# EAGLE design SimpleLedEgg (EAGLE 9.6.2)
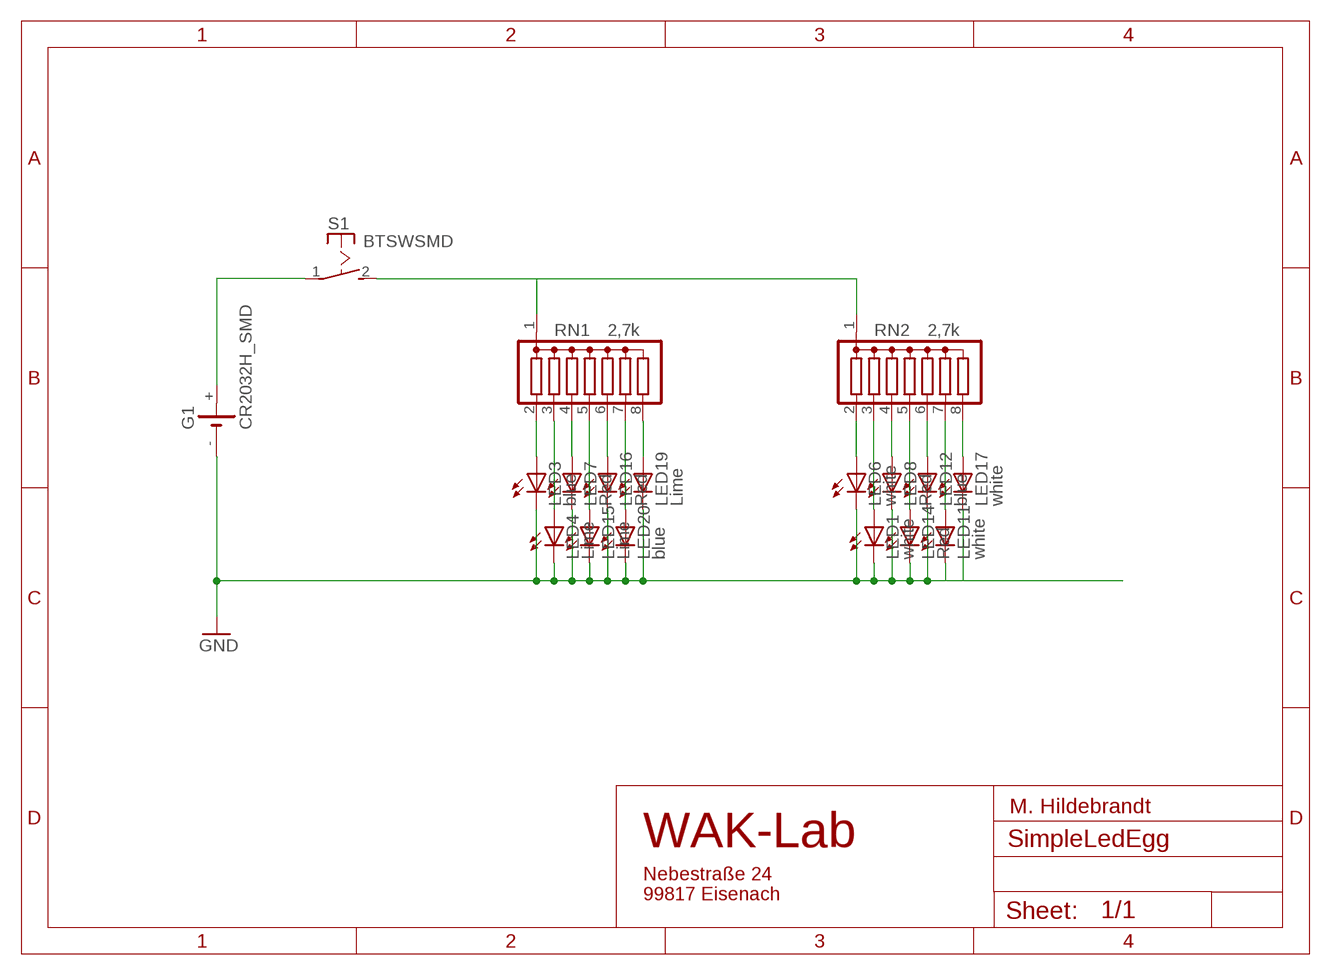
[diagram p0: schematic, sheet 1]

## Parts
G1  CR2032H_SMD  [CR2032H_SMD]
LED1  white  LED3MM  [LED3MM]
LED3  blue  LED3MM  [LED3MM]
LED4  Lime  LED3MM  [LED3MM]
LED6  white  LED3MM  [LED3MM]
LED7  Red  LED3MM  [LED3MM]
LED8  Red  LED3MM  [LED3MM]
LED11  white  LED3MM  [LED3MM]
LED12  blue  LED3MM  [LED3MM]
LED14  Red  LED3MM  [LED3MM]
LED15  Lime  LED3MM  [LED3MM]
LED16  Red  LED3MM  [LED3MM]
LED17  white  LED3MM  [LED3MM]
LED19  Lime  LED3MM  [LED3MM]
LED20  blue  LED3MM  [LED3MM]
RN1  2,7k  G07R  [SIL8]
RN2  2,7k  G07R  [SIL8]
S1  BTSWSMD  [BTSW_SMD]

## Nets
GND: G1.- LED1.K(C) LED3.K(C) LED4.K(C) LED6.K(C) LED7.K(C) LED8.K(C) LED11.K(C) LED12.K(C) LED14.K(C) LED15.K(C) LED16.K(C) LED17.K(C) LED19.K(C) LED20.K(C)
N$1: RN1.1 RN2.1 S1.2(S)
N$2: LED3.A RN1.2
N$3: LED4.A RN1.3
N$4: LED7.A RN1.4
N$5: LED15.A RN1.5
N$6: LED16.A RN1.6
N$7: LED20.A RN1.7
N$8: LED19.A RN1.8
N$9: LED6.A RN2.2
N$10: LED1.A RN2.3
N$11: LED8.A RN2.4
N$12: LED12.A RN2.6
N$13: LED14.A RN2.5
N$14: LED11.A RN2.7
N$15: LED17.A RN2.8
N$49: G1.+ S1.1(P)

## Notes on the sheet
- M. Hildebrandt
- WAK-Lab
- Nebestraße 24
  99817 Eisenach

## Library data of the parts
G1 = battery:CR2032H_SMD
LED1 LED3 LED4 LED6-LED8 LED11 LED12 LED14-LED17 LED19 LED20 = led:LED: LED OSRAM: - CHIPLED LG R971, LG N971, LY N971, LG Q971, LY Q971, LO R971, LY R971 LH N974, LH R974 LS Q976, LO Q976, LY Q976 LO Q996 - Hyper CHIPLED LW Q18S LB Q993, LB Q99A, LB R99A - SideLED LS A670, LO A670, LY A670, LG A670, LP A670 LB A673, LV A673, LT A673, LW A673 LH A674 LY A675 LS A676, LA A676, LO A676, LY A676, LW A676 LS A679, LY A679, LG A679 - Hyper Micro SIDELED® LS Y876, LA Y876, LO Y876, LY Y876 LT Y87S - SmartLED LW L88C, LW L88S LB L89C, LB L89S, LG L890 LS L89K, LO L89K, LY L89K LS L896, LA L896, LO L896, LY L896 - TOPLED LS T670, LO T670, LY T670, LG T670, LP T670 LSG T670, LSP T670, LSY T670, LOP T670, LYG T670 LG T671, LOG T671, LSG T671 LB T673, LV T673, LT T673, LW T673 LH T674 LS T676, LA T676, LO T676, LY T676, LB T676, LH T676, LSB T676, LW T676 LB T67C, LV T67C, LT T67C, LS T67K, LO T67K, LY T67K, LW E67C LS E67B, LA E67B, LO E67B, LY E67B, LB E67C, LV E67C, LT E67C LW T67C LS T679, LY T679, LG T679 LS T770, LO T770, LY T770, LG T770, LP T770 LB T773, LV T773, LT T773, LW T773 LH T774 LS E675, LA E675, LY E675, LS T675 LS T776, LA T776, LO T776, LY T776, LB T776 LHGB T686 LT T68C, LB T68C - Hyper Mini TOPLED® LB M676 - Mini TOPLED Santana® LG M470 LS M47K, LO M47K, LY M47K Source: http://www.osram.convergy.de LUXEON: - LUMILED® LXK2-PW12-R00, LXK2-PW12-S00, LXK2-PW14-U00, LXK2-PW14-V00 LXK2-PM12-R00, LXK2-PM12-S00, LXK2-PM14-U00 LXK2-PE12-Q00, LXK2-PE12-R00, LXK2-PE12-S00, LXK2-PE14-T00, LXK2-PE14-U00 LXK2-PB12-K00, LXK2-PB12-L00, LXK2-PB12-M00, LXK2-PB14-N00, LXK2-PB14-P00, LXK2-PB14-Q00 LXK2-PR12-L00, LXK2-PR12-M00, LXK2-PR14-Q00, LXK2-PR14-R00 LXK2-PD12-Q00, LXK2-PD12-R00, LXK2-PD12-S00 LXK2-PH12-R00, LXK2-PH12-S00 LXK2-PL12-P00, LXK2-PL12-Q00, LXK2-PL12-R00 Source: www.luxeon.com KINGBRIGHT: KA-3528ASYC Source: www.kingbright.com
RN1 RN2 = resistor-sil:G07R: SIL RESISTOR; OC_FARNELL: unknown; OC_NEWARK: unknown
S1 = DIY-Parts:BTSW

## Board
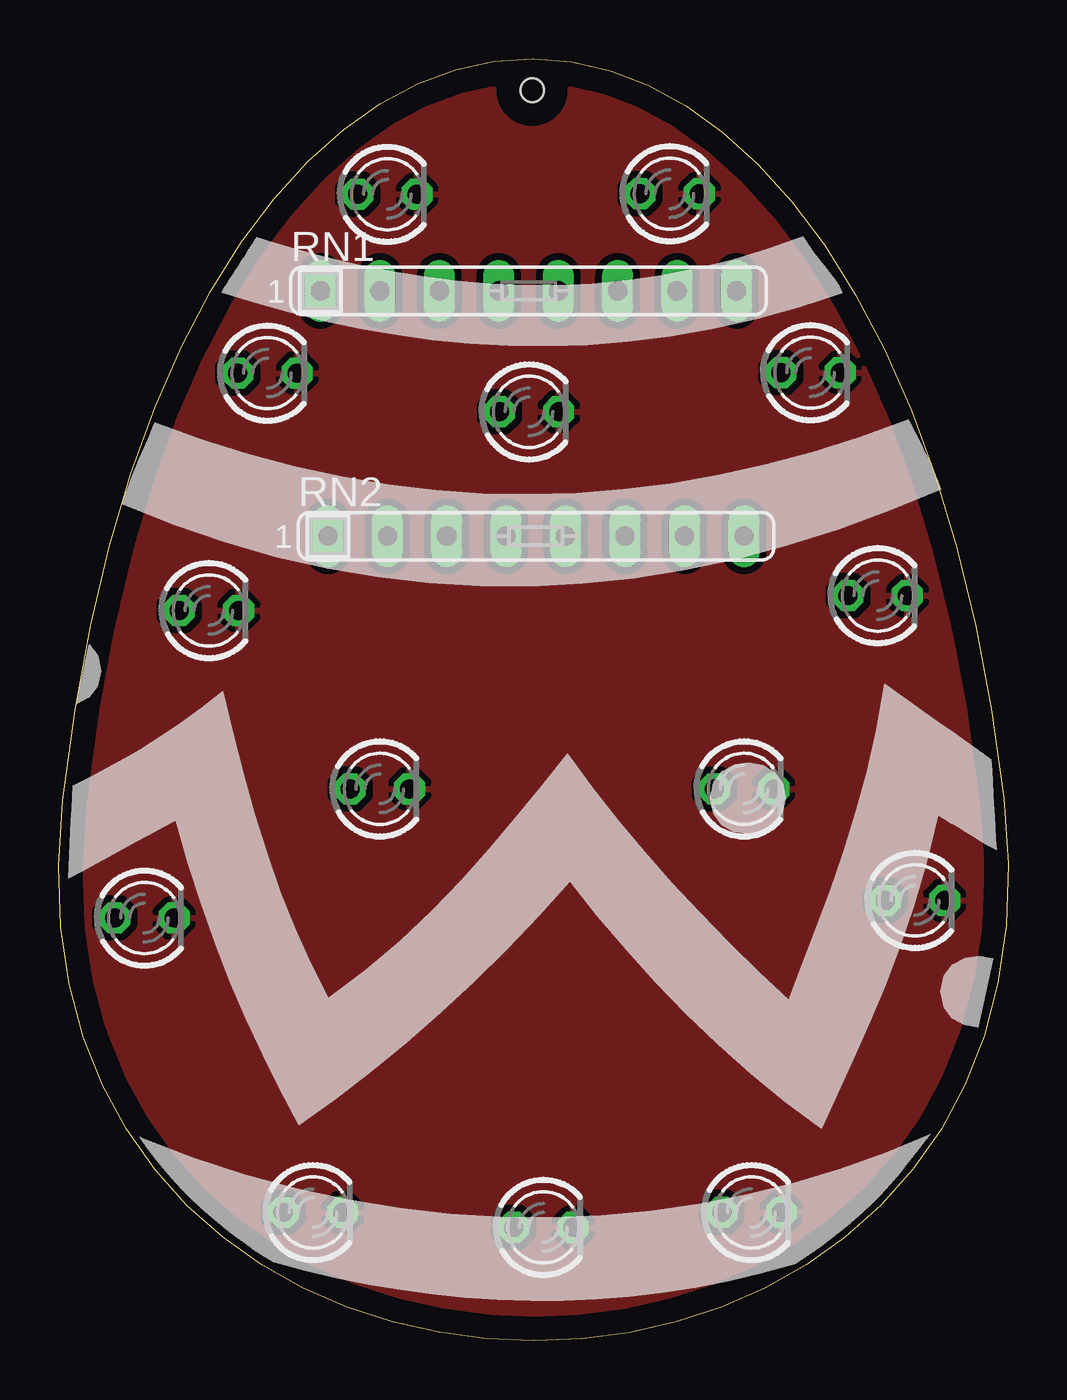
[diagram p1: board, top side]
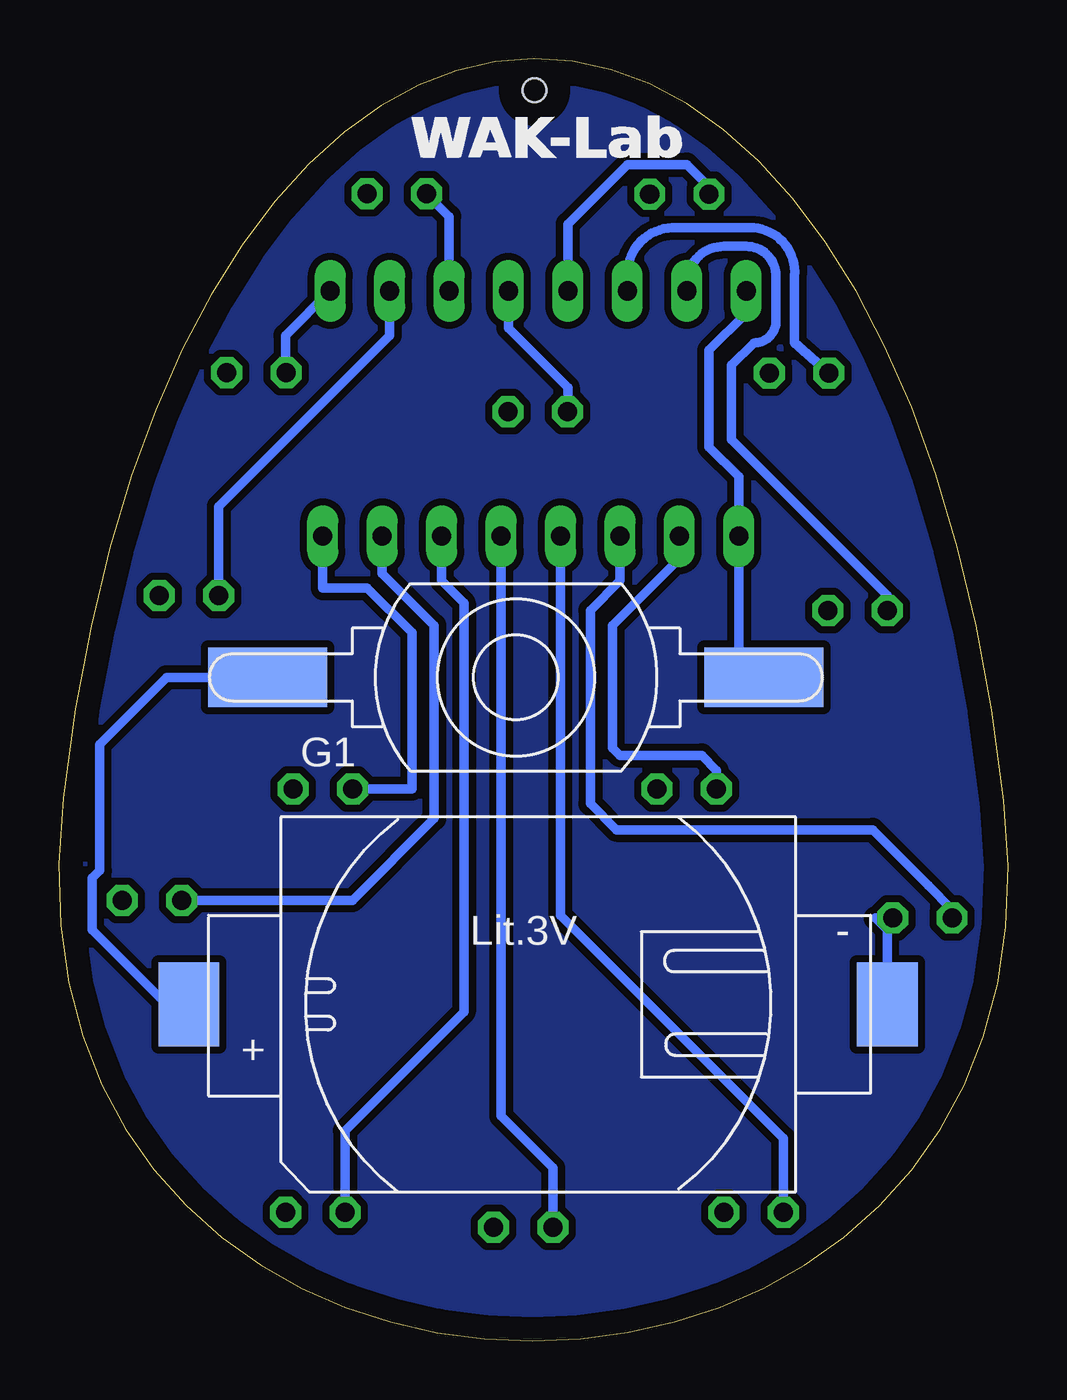
[diagram p2: board, bottom side, seen from below]

Size 40.58 x 54.79 mm. Coordinates in mm from the lower left corner, seen from the top.
Outline: 0.18,23.09 0.71,26.96 1.37,30.57 2.17,33.93 3.09,37.03 4.12,39.89 5.26,42.49 6.49,44.84 7.81,46.94 9.2,48.8 10.66,50.4 12.18,51.75 13.74,52.85 15.34,53.71 16.97,54.32 18.61,54.68 20.27,54.79 21.93,54.65 23.57,54.27 25.2,53.64 26.8,52.76 28.37,51.64 29.88,50.28 31.34,48.66 32.74,46.81 34.05,44.71 35.29,42.36 36.43,39.77 37.46,36.94 38.39,33.87 39.19,30.55 39.86,26.99 40.39,23.19 40.58,20.38 40.49,17.75 40.14,15.3 39.55,13.04 38.73,10.95 37.71,9.05 36.5,7.33 35.13,5.79 33.61,4.43 31.95,3.25 30.18,2.26 28.33,1.45 26.39,0.81 24.4,0.36 22.37,0.09 20.33,0 18.28,0.09 16.25,0.36 14.26,0.82 12.32,1.45 10.46,2.26 8.69,3.25 7.03,4.43 5.5,5.78 4.12,7.32 2.91,9.03 1.88,10.93 1.06,13 0.46,15.25 0.1,17.69 0,20.3 0.18,23.09
Copper layers (1*16): Top 0.035mm / dielectric 1.5mm / Bottom 0.035mm
Design rules "default": minimum track width 6mil, minimum drill 0.35mm, track to track 6mil, track to pad 6mil, pad to pad 6mil, via to via 6mil, smd to smd 6mil, copper to edge 40mil, drill to drill 6mil, minimum pad ring 10mil, minimum via ring 8mil, stop-mask expansion 4mil, vias tented up to drill 0mil, thermal gap 10mil
Holes 1 mm at 20.24,53.43

### Footprints (pad centres in the part's own frame; a part is rotated, then mirrored left to right if it is on the bottom)
CR2032H_SMD = smd 2.6 x 3.6: + -14.922,0; - 14.922,0
LED3MM = drill 0.813 octagon: A -1.27,0; K 1.27,0
SIL8 = drill 0.813 long: 1 -8.89,0; 2 -6.35,0; 3 -3.81,0; 4 -1.27,0; 5 1.27,0; 6 3.81,0; 7 6.35,0; 8 8.89,0
BTSW_SMD = smd 5.08 x 2.54: 1 -10.6,0; 2 10.6,0

### Placement (x,y rotation side)
G1  20.08,14.38 0 bottom
LED1  3.67,18.07 0 top
LED3  6.43,31.21 0 top
LED4  8.93,41.35 0 top
LED6  13.73,23.59 0 top
LED7  14.05,48.99 0 top
LED8  10.87,5.49 0 top
LED11  36.59,18.82 0 top
LED12  29.61,5.49 0 top
LED14  20.72,4.85 0 top
LED15  20.1,39.69 0 top
LED16  26.12,49.01 0 top
LED17  29.29,23.59 0 top
LED19  32.13,41.37 0 top
LED20  35,31.84 0 top
RN1  20.08,44.86 0 top
RN2  20.4,34.38 0 top
S1  21.03,28.35 0 bottom

### Tracks (layer width: path | path; a pad name or v marks a point on that pad's centre or on a via)
GND
  Bottom 0.406: G1.- 5.16,17.55 5.67,18.07 LED1.K
  pour Top (isolate 0.305): 0.71,26.96 1.37,30.57 2.17,33.93 3.09,37.03 4.12,39.89 5.26,42.49 6.49,44.84 7.81,46.94 9.2,48.8 10.66,50.4 12.18,51.75 13.74,52.85 15.34,53.71 16.97,54.32 18.61,54.68 20.27,54.79 21.93,54.65 23.57,54.27 25.2,53.64 26.8,52.76 28.37,51.64 29.88,50.28 31.34,48.66 32.74,46.81 34.05,44.71 35.29,42.36 36.43,39.77 37.46,36.94 38.39,33.87 39.19,30.55 39.86,26.99 40.39,23.19 40.58,20.38 40.49,17.75 40.14,15.3 39.55,13.04 38.73,10.95 37.71,9.05 36.5,7.33 35.13,5.79 33.61,4.43 31.95,3.25 30.18,2.26 28.33,1.45 26.39,0.81 24.4,0.36 22.37,0.09 20.33,0 18.28,0.09 16.25,0.36 14.26,0.82 12.32,1.45 10.46,2.26 8.69,3.25 7.03,4.43 5.5,5.78 4.12,7.32 2.91,9.03 1.88,10.93 1.06,13 0.46,15.25 0.1,17.69 0,20.3 0.18,23.09
N$1
  Bottom 0.406: RN1.1 11.19,43.91 12.78,42.32 12.78,38.19 11.51,36.92 RN2.1 11.51,29.42 S1.2
N$2
  Bottom 0.406: RN1.2 13.73,45.18 arc90 12.14,46.76 11.19,46.76 arc90 9.92,45.5 9.92,43.59 arc90 10.87,42.64 11.83,41.69 11.83,38.51 5.16,31.84 LED3.A
N$3
  Bottom 0.406: RN1.3 16.27,45.5 arc90 14.37,47.56 10.87,47.56 arc90 9.13,45.5 9.13,42.66 LED4.A
N$4
  Bottom 0.406: RN1.4 18.81,47.72 16.27,50.26 13.73,50.26 12.78,49.3 LED7.A
N$5
  Bottom 0.406: RN1.5 21.35,43.27 18.81,40.73 18.81,39.72 LED15.A
N$6
  Bottom 0.406: RN1.6 23.89,48.04 24.85,48.99 LED16.A
N$7
  Bottom 0.406: RN1.7 26.43,42.95 33.73,35.65 LED20.A
N$8
  Bottom 0.406: RN1.8 30.88,42.95 30.88,41.35 | 30.88,41.05 30.88,41.35 | 30.88,41.35 LED19.A
N$9
  Bottom 0.406: RN2.2 14.05,33.43 16.91,30.57 16.91,25.33 16.59,25.02 13.1,25.02 12.46,24.38 LED6.A
N$10
  Bottom 0.406: RN2.3 16.59,32.48 17.86,31.21 17.86,22.95 16.75,21.84 5.79,21.84 3.41,19.46 2.4,18.41 LED1.A
N$11
  Bottom 0.406: LED8.A 9.6,8.66 19.13,18.19 RN2.4
N$12
  Bottom 0.406: RN2.6 24.21,32.48 23.26,31.53 23.26,14.06 28.34,8.98 28.34,5.81 28.02,5.49 LED12.A
N$13
  Bottom 0.406: RN2.5 21.67,9.62 19.45,7.4 LED14.A
N$14
  Bottom 0.406: RN2.7 26.75,32.8 24.53,30.57 24.53,22.32 28.02,18.83 LED11.A
N$15
  Bottom 0.406: RN2.8 29.29,32.16 27.38,32.16 25.48,30.26 25.48,23.59 LED17.A
N$49
  Bottom 0.406: G1.+ 35.64,14.06 39.13,17.55 39.13,19.78 38.81,20.1 38.81,25.49 35.96,28.35 S1.1 31.51,28.35
UNCON
  pour Bottom (isolate 0.305): 0.71,26.96 1.37,30.57 2.17,33.93 3.09,37.03 4.12,39.89 5.26,42.49 6.49,44.84 7.81,46.94 9.2,48.8 10.66,50.4 12.18,51.75 13.74,52.85 15.34,53.71 16.97,54.32 18.61,54.68 20.27,54.79 21.93,54.65 23.57,54.27 25.2,53.64 26.8,52.76 28.37,51.64 29.88,50.28 31.34,48.66 32.74,46.81 34.05,44.71 35.29,42.36 36.43,39.77 37.46,36.94 38.39,33.87 39.19,30.55 39.86,26.99 40.39,23.19 40.58,20.38 40.49,17.75 40.14,15.3 39.55,13.04 38.73,10.95 37.71,9.05 36.5,7.33 35.13,5.79 33.61,4.43 31.95,3.25 30.18,2.26 28.33,1.45 26.39,0.81 24.4,0.36 22.37,0.09 20.33,0 18.28,0.09 16.25,0.36 14.26,0.82 12.32,1.45 10.46,2.26 8.69,3.25 7.03,4.43 5.5,5.78 4.12,7.32 2.91,9.03 1.88,10.93 1.06,13 0.46,15.25 0.1,17.69 0,20.3 0.18,23.09